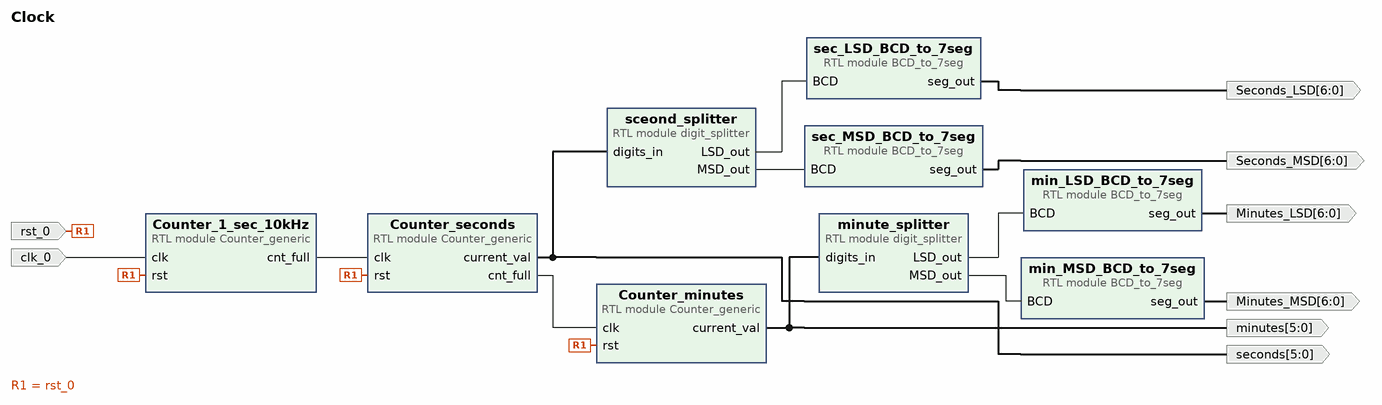
[diagram p0: block diagram of the top level]
# Vivado block design Clock, xc7z020clg400-1, Vivado 2023.2
create_bd_design Clock

create_bd_port -dir I -type clk clk_0
create_bd_port -dir I -type rst rst_0
create_bd_port -dir O -from 5 -to 0 seconds
create_bd_port -dir O -from 5 -to 0 minutes
create_bd_port -dir O -from 6 -to 0 Seconds_LSD
create_bd_port -dir O -from 6 -to 0 Seconds_MSD
create_bd_port -dir O -from 6 -to 0 Minutes_LSD
create_bd_port -dir O -from 6 -to 0 Minutes_MSD

create_bd_cell -type module -reference Counter_generic Counter_1_sec_10kHz
set_property -dict {CONFIG.bit_width 14 CONFIG.max_val 9999} [get_bd_cells Counter_1_sec_10kHz]
create_bd_cell -type module -reference Counter_generic Counter_seconds
set_property -dict {CONFIG.bit_width 6 CONFIG.max_val 59} [get_bd_cells Counter_seconds]
create_bd_cell -type module -reference Counter_generic Counter_minutes
set_property -dict {CONFIG.bit_width 6 CONFIG.max_val 59} [get_bd_cells Counter_minutes]
create_bd_cell -type module -reference digit_splitter sceond_splitter
create_bd_cell -type module -reference digit_splitter minute_splitter
create_bd_cell -type module -reference BCD_to_7seg min_LSD_BCD_to_7seg
create_bd_cell -type module -reference BCD_to_7seg sec_LSD_BCD_to_7seg
create_bd_cell -type module -reference BCD_to_7seg min_MSD_BCD_to_7seg
create_bd_cell -type module -reference BCD_to_7seg sec_MSD_BCD_to_7seg

# ---- connections ----

connect_bd_net -net Counter_1_sec_cnt_full [get_bd_pins Counter_1_sec_10kHz/cnt_full] [get_bd_pins Counter_seconds/clk]
connect_bd_net [get_bd_pins Counter_minutes/current_val] [get_bd_ports minutes] [get_bd_pins minute_splitter/digits_in]
connect_bd_net [get_bd_pins Counter_seconds/cnt_full] [get_bd_pins Counter_minutes/clk]
connect_bd_net [get_bd_pins Counter_seconds/current_val] [get_bd_ports seconds] [get_bd_pins sceond_splitter/digits_in]
connect_bd_net -net clk_0_1 [get_bd_ports clk_0] [get_bd_pins Counter_1_sec_10kHz/clk]
connect_bd_net [get_bd_pins min_LSD_BCD_to_7seg/seg_out] [get_bd_ports Minutes_LSD]
connect_bd_net [get_bd_pins min_MSD_BCD_to_7seg/seg_out] [get_bd_ports Minutes_MSD]
connect_bd_net [get_bd_pins minute_splitter/LSD_out] [get_bd_pins min_LSD_BCD_to_7seg/BCD]
connect_bd_net [get_bd_pins minute_splitter/MSD_out] [get_bd_pins min_MSD_BCD_to_7seg/BCD]
connect_bd_net -net rst_0_1 [get_bd_ports rst_0] \
  [get_bd_pins Counter_seconds/rst] [get_bd_pins Counter_minutes/rst] [get_bd_pins Counter_1_sec_10kHz/rst]
connect_bd_net [get_bd_pins sceond_splitter/LSD_out] [get_bd_pins sec_LSD_BCD_to_7seg/BCD]
connect_bd_net [get_bd_pins sceond_splitter/MSD_out] [get_bd_pins sec_MSD_BCD_to_7seg/BCD]
connect_bd_net [get_bd_pins sec_LSD_BCD_to_7seg/seg_out] [get_bd_ports Seconds_LSD]
connect_bd_net [get_bd_pins sec_MSD_BCD_to_7seg/seg_out] [get_bd_ports Seconds_MSD]

validate_bd_design
save_bd_design
